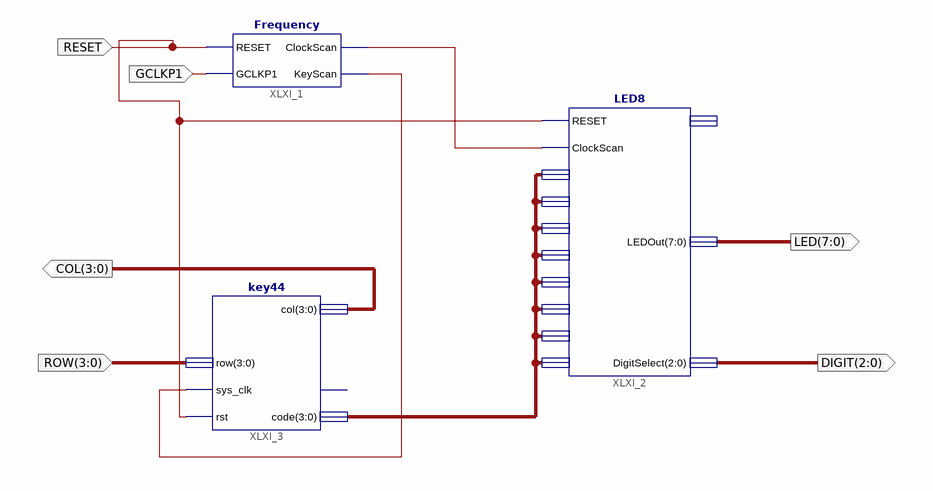
[diagram p0: schematic sheet 1]
// Xilinx ISE schematic key.sch (spartan3e) as structural Verilog: 3 symbols, 6 ports
module key (
  input  [3:0] ROW,
  input  GCLKP1,
  input  RESET,
  output [3:0] COL,
  output [7:0] LED,
  output [2:0] DIGIT
);

  wire XLXN_1, XLXN_2;
  wire [3:0] XLXN_10;

  Frequency XLXI_1 (.RESET(RESET), .GCLKP1(GCLKP1), .ClockScan(XLXN_1), .KeyScan(XLXN_2));
  LED8 XLXI_2 (
    .RESET(RESET), .ClockScan(XLXN_1), .LED1(XLXN_10), .LED2(XLXN_10), .LED3(XLXN_10), .LED4(XLXN_10),
    .LED5(XLXN_10), .LED6(XLXN_10), .LED7(XLXN_10), .LED8(XLXN_10), .LEDOut(LED), .DigitSelect(DIGIT));  // open: light
  key44 XLXI_3 (.sys_clk(XLXN_2), .rst(RESET), .row(ROW), .code(XLXN_10), .col(COL));  // open: valid
endmodule
